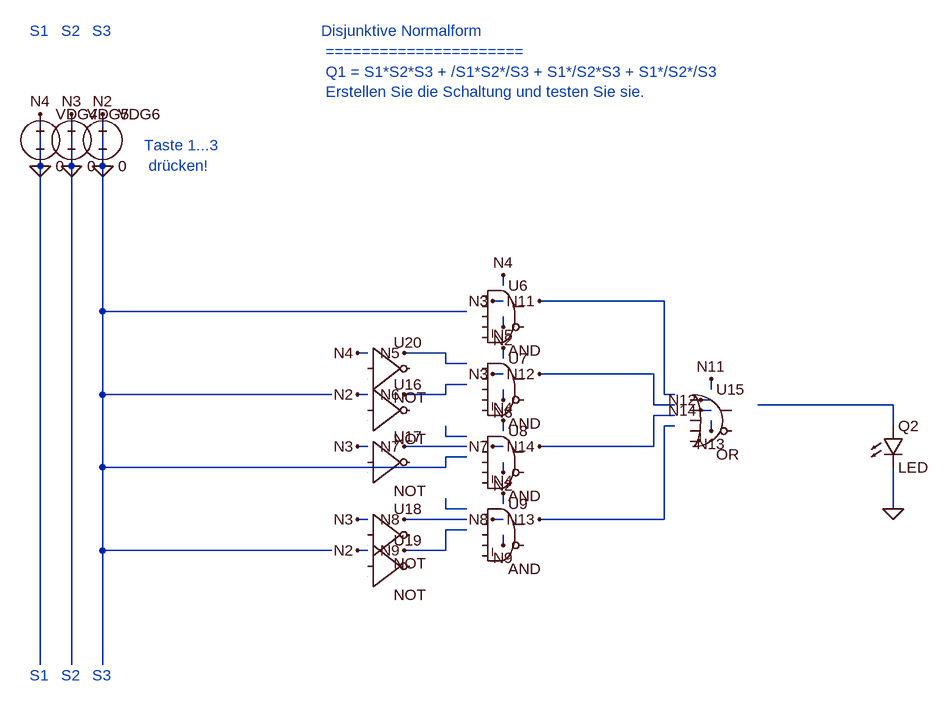
[diagram p0: schematic 2_0_Disjunktive_Normalform_Lsg.asc]
2_0_Disjunktive_Normalform_Lsg.asc, the LTspice schematic file:
Version 4
SHEET 1 880 680
WIRE 1488 720 1488 752
WIRE 1488 752 1488 784
WIRE 960 464 1136 464
WIRE 1136 464 1136 608
WIRE 1136 608 1152 608
WIRE 960 576 1120 576
WIRE 1120 576 1120 624
WIRE 1120 624 1152 624
WIRE 960 800 1136 800
WIRE 1136 800 1136 656
WIRE 1136 656 1152 656
WIRE 960 688 1120 688
WIRE 1120 688 1120 640
WIRE 1120 640 1152 640
WIRE 272 1024 272 848
WIRE 176 1024 176 768
WIRE 176 448 176 176
WIRE 224 464 224 176
WIRE 272 480 272 176
WIRE 832 480 272 480
WIRE 832 560 800 560
WIRE 800 560 800 544
WIRE 800 544 752 544
WIRE 224 1024 224 800
WIRE 224 576 224 464
WIRE 832 592 800 592
WIRE 800 592 800 608
WIRE 800 608 752 608
WIRE 176 544 176 448
WIRE 272 608 272 480
WIRE 624 608 272 608
WIRE 176 656 176 544
WIRE 832 672 800 672
WIRE 800 672 800 656
WIRE 832 688 752 688
WIRE 224 688 224 576
WIRE 224 800 224 688
WIRE 176 768 176 656
WIRE 832 784 800 784
WIRE 800 784 800 768
WIRE 752 800 832 800
WIRE 752 848 800 848
WIRE 800 848 800 816
WIRE 800 816 832 816
WIRE 272 848 272 720
WIRE 624 848 272 848
WIRE 272 720 272 608
WIRE 832 704 800 704
WIRE 800 704 800 720
WIRE 800 720 272 720
WIRE 1280 624 1488 624
WIRE 1488 624 1488 656
WIRE 960 464 944 464
WIRE 1208 600 1208 584
WIRE 960 576 944 576
WIRE 1208 616 1192 616
WIRE 960 800 944 800
WIRE 1208 648 1208 664
WIRE 960 688 944 688
WIRE 1208 632 1192 632
WIRE 680 608 664 608
WIRE 680 848 664 848
WIRE 888 488 888 504
WIRE 888 712 888 728
WIRE 680 688 664 688
WIRE 888 576 872 576
WIRE 888 464 872 464
WIRE 680 800 664 800
WIRE 888 664 888 648
WIRE 680 544 664 544
WIRE 888 440 888 424
WIRE 888 776 888 760
WIRE 888 552 888 536
WIRE 752 544 736 544
WIRE 888 600 888 616
WIRE 752 608 736 608
WIRE 888 688 872 688
WIRE 752 688 736 688
WIRE 752 800 736 800
WIRE 888 800 872 800
WIRE 752 848 736 848
WIRE 888 824 888 840
FLAG 176 256 0
FLAG 224 256 0
FLAG 272 256 0
FLAG 1488 784 0
FLAG 944 464 N11
FLAG 1208 584 N11
FLAG 944 576 N12
FLAG 1192 616 N12
FLAG 944 800 N13
FLAG 1208 664 N13
FLAG 944 688 N14
FLAG 1192 632 N14
FLAG 664 608 N2
FLAG 664 848 N2
FLAG 272 176 N2
FLAG 888 504 N2
FLAG 888 728 N2
FLAG 664 688 N3
FLAG 872 576 N3
FLAG 224 176 N3
FLAG 872 464 N3
FLAG 664 800 N3
FLAG 888 648 N4
FLAG 664 544 N4
FLAG 176 176 N4
FLAG 888 424 N4
FLAG 888 760 N4
FLAG 888 536 N5
FLAG 736 544 N5
FLAG 888 616 N6
FLAG 736 608 N6
FLAG 872 688 N7
FLAG 736 688 N7
FLAG 736 800 N8
FLAG 872 800 N8
FLAG 736 848 N9
FLAG 888 840 N9
SYMBOL LED 1472 656 R0
SYMATTR InstName Q2
SYMATTR Value LED
SYMBOL Digital\and 888 424 R0
SYMATTR InstName U6
SYMATTR Value AND
SYMATTR LibreSpice gate=and;inputs=3;vth=2.5;vhigh=5;pins=In1,In2,In3,Out
SYMBOL Digital\and 888 536 R0
SYMATTR InstName U7
SYMATTR Value AND
SYMATTR LibreSpice gate=and;inputs=3;vth=2.5;vhigh=5;pins=In1,In2,In3,Out
SYMBOL Digital\and 888 648 R0
SYMATTR InstName U8
SYMATTR Value AND
SYMATTR LibreSpice gate=and;inputs=3;vth=2.5;vhigh=5;pins=In1,In2,In3,Out
SYMBOL Digital\and 888 760 R0
SYMATTR InstName U9
SYMATTR Value AND
SYMATTR LibreSpice gate=and;inputs=3;vth=2.5;vhigh=5;pins=In1,In2,In3,Out
SYMBOL Digital\or 1208 584 R0
SYMATTR InstName U15
SYMATTR Value OR
SYMATTR LibreSpice gate=or;inputs=4;vth=2.5;vhigh=5;pins=In1,In2,In3,In4,Out
SYMBOL Digital\inv 680 568 R0
SYMATTR InstName U16
SYMATTR Value NOT
SYMATTR LibreSpice gate=not;inputs=1;vth=2.5;vhigh=5;pins=In1,Out
SYMBOL Digital\inv 680 648 R0
SYMATTR InstName U17
SYMATTR Value NOT
SYMATTR LibreSpice gate=not;inputs=1;vth=2.5;vhigh=5;pins=In1,Out
SYMBOL Digital\inv 680 760 R0
SYMATTR InstName U18
SYMATTR Value NOT
SYMATTR LibreSpice gate=not;inputs=1;vth=2.5;vhigh=5;pins=In1,Out
SYMBOL Digital\inv 680 808 R0
SYMATTR InstName U19
SYMATTR Value NOT
SYMATTR LibreSpice gate=not;inputs=1;vth=2.5;vhigh=5;pins=In1,Out
SYMBOL Digital\inv 680 504 R0
SYMATTR InstName U20
SYMATTR Value NOT
SYMATTR LibreSpice gate=not;inputs=1;vth=2.5;vhigh=5;pins=In1,Out
SYMBOL voltage 176 160 R0
SYMATTR InstName VDG4
SYMATTR Value 0
SYMBOL voltage 224 160 R0
SYMATTR InstName VDG5
SYMATTR Value 0
SYMBOL voltage 272 160 R0
SYMATTR InstName VDG6
SYMATTR Value 0
TEXT 608 48 Left 2 ;Disjunktive Normalform \n ====================== \n Q1 = S1*S2*S3 + /S1*S2*/S3 + S1*/S2*S3 + S1*/S2*/S3 \n Erstellen Sie die Schaltung und testen Sie sie.
TEXT 160 48 Left 2 ;S1
TEXT 208 48 Left 2 ;S2
TEXT 256 48 Left 2 ;S3
TEXT 160 1040 Left 2 ;S1
TEXT 208 1040 Left 2 ;S2
TEXT 256 1040 Left 2 ;S3
TEXT 336 224 Left 2 ;Taste 1...3 \n drücken!

The netlist it stands for:
* 2_0_Disjunktive_Normalform_Lsg.asc
D§Q2 N003 0 LED
A§U6 0 0 0 0 0 0 0 0 AND AND
A§U7 0 0 0 0 0 0 0 0 AND AND
A§U8 0 0 0 0 0 0 0 0 AND AND
A§U9 0 0 0 0 0 0 0 0 AND AND
A§U15 0 0 0 0 0 0 0 0 OR OR
A§U16 0 0 0 0 0 0 0 0 BUF NOT
A§U17 0 0 0 0 0 0 0 0 BUF NOT
A§U18 0 0 0 0 0 0 0 0 BUF NOT
A§U19 0 0 0 0 0 0 0 0 BUF NOT
A§U20 0 0 0 0 0 0 0 0 BUF NOT
VDG4 0 0 0
VDG5 0 0 0
VDG6 0 0 0
.model D D
.lib standard.dio
* Disjunktive Normalform
*  ======================
*  Q1 = S1*S2*S3 + /S1*S2*/S3 + S1*/S2*S3 + S1*/S2*/S3
*  Erstellen Sie die Schaltung und testen Sie sie.
* S1
* S2
* S3
* S1
* S2
* S3
* Taste 1...3
*  drücken!
.backanno
.end